# EasyEDA schematic DPSD_NANO_2020-07-29_17-39-39.json
TITLE: Sheet_1; REV: 1.0; Date: 2019-01-28; Sheet: 1/1; Drawn By: ahmetakifkaya11; Company: Your Company
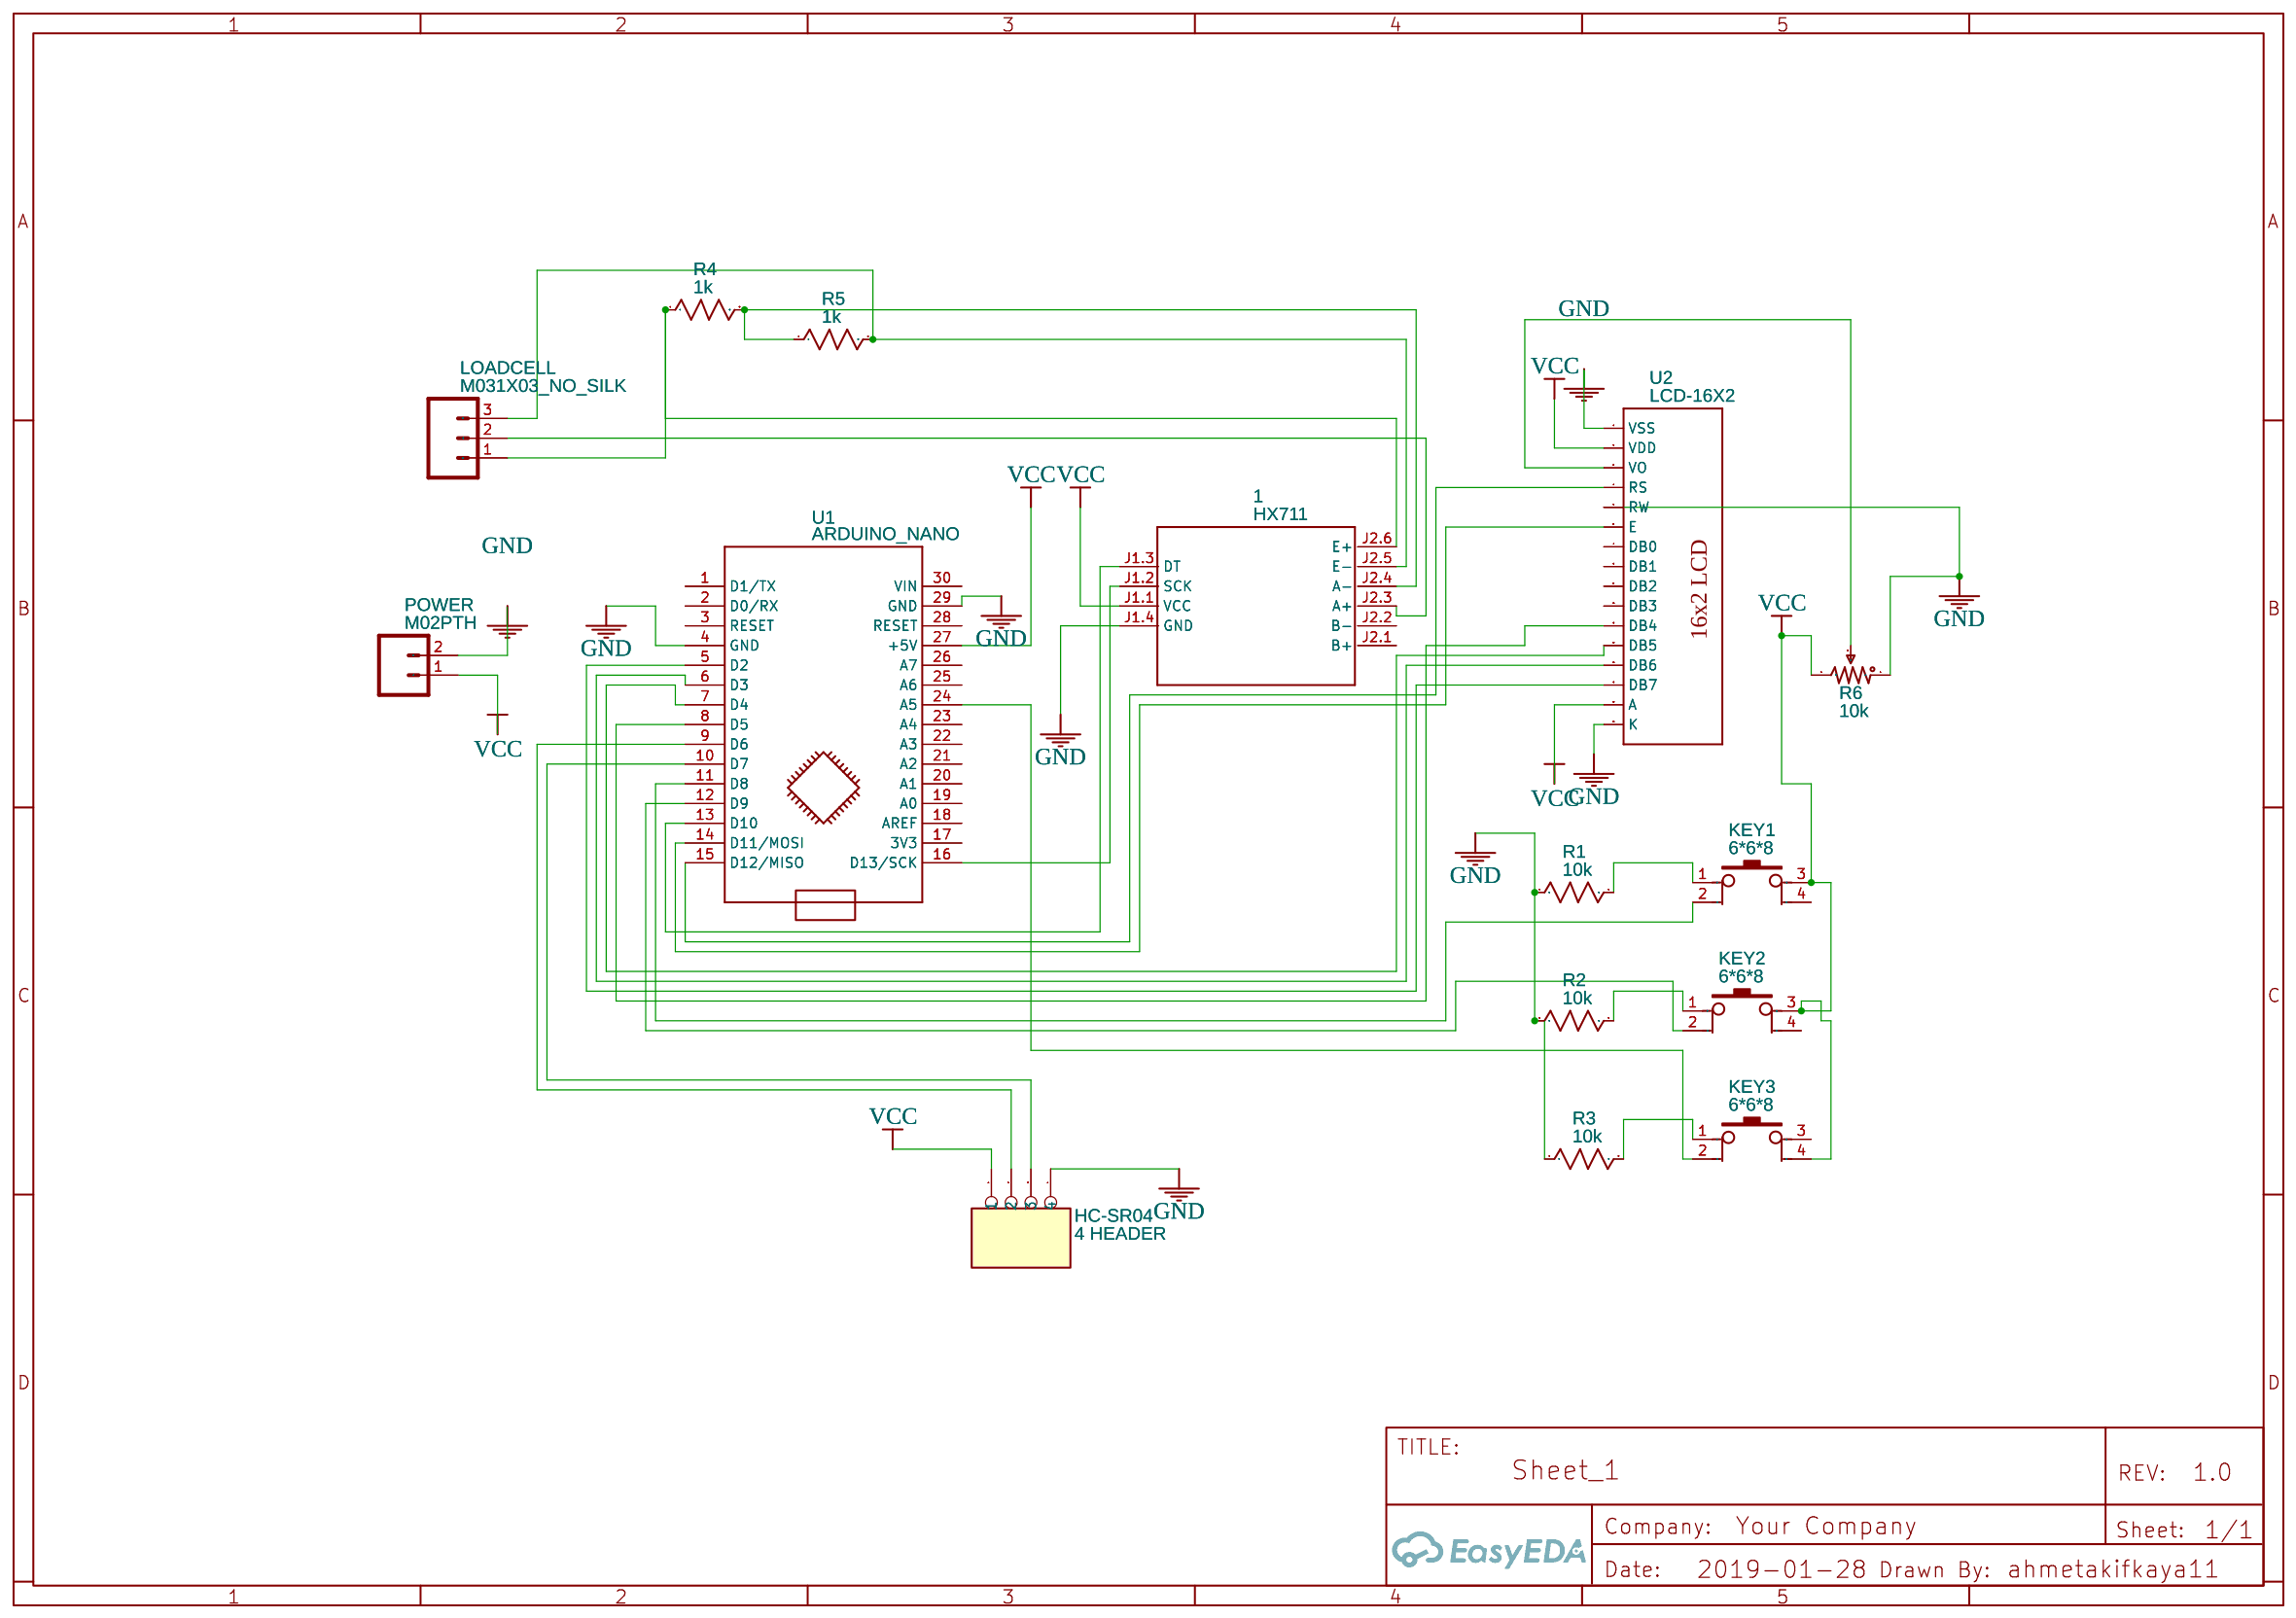
[diagram p0: schematic sheet]

## Parts
1  HX711  [HX711]
HC-SR04  4 HEADER  [HEADER4]
KEY1  6*6*8  [KEY-6.0*6.0-2]
KEY2  6*6*8  [KEY-6.0*6.0-2]
KEY3  6*6*8  [KEY-6.0*6.0-2]
LOADCELL  M031X03_NO_SILK  [1X03_NO_SILK]
POWER  M02PTH  [1X02]
R1  10k  [AXIAL-0.3]
R2  10k  [AXIAL-0.3]
R3  10k  [AXIAL-0.3]
R4  1k  [AXIAL-0.3]
R5  1k  [AXIAL-0.3]
R6  10k  [RES-ADJ_3386P]
U1  ARDUINO_NANO  [ARDUINO_NANO]
U2  LCD-16X2  [LCD-16X2]

## Library data of the parts
1 = -: Contributor: Krzysztof Handzlik; Manufacturer Part: ?
HC-SR04 = -: 4 Pin Header; Manufacturer Part: ?
KEY1-KEY3 = -: Supplier Part: C59982; Supplier: LCSC; Manufacturer: ReliaPro; Manufacturer Part: button6*6*8
LOADCELL = -: Header 3; Manufacturer Part: ?
POWER = -: Header 2; Manufacturer Part: ?
R1-R5 = Res_AXIAL-0.3(1/8W)_US: Manufacturer Part: ?
R6 = 3386P-1-101LF_US: Supplier: LCSC; Manufacturer: Bochen; Manufacturer Part: 3386P-1-101LF; Contributor: EasyEDA; Supplier Part: C125022
U1 = -: sourceId: KGSeAWhDB; Manufacturer Part: ?
U2 = -: Contributor: SparkFun; Manufacturer Part: ?

## Nets
GND: 1.J1.4(GND) HC-SR04.4 POWER.2 R1.1 R2.1 R3.1 R6.1 U1.4(GND) U1.29(GND) U2.1(VSS) U2.5(RW) U2.16(K)
VCC: 1.J1.1(VCC) HC-SR04.1 KEY1.3 KEY2.3 KEY3.4 POWER.1 R6.3 U1.27(+5V) U2.2(VDD) U2.15(A)
Net-(1-J1.2): 1.J1.2(SCK) U1.16(D13/SCK)
Net-(1-J1.3): 1.J1.3(DT) U1.13(D10)
Net-(1-J2.3): 1.J2.3(A+) LOADCELL.2
Net-(1-J2.4): 1.J2.4(A-) R4.2 R5.1
Net-(1-J2.5): 1.J2.5(E-) LOADCELL.3 R5.2
Net-(1-J2.6): 1.J2.6(E+) LOADCELL.1 R4.1
Net-(HC-SR04-2): HC-SR04.2 U1.9(D6)
Net-(HC-SR04-3): HC-SR04.3 U1.10(D7)
Net-(KEY1-1): KEY1.1 R1.2
Net-(KEY1-2): KEY1.2 U1.11(D8)
Net-(KEY2-1): KEY2.1 R2.2
Net-(KEY2-2): KEY2.2 U1.12(D9)
Net-(KEY3-1): KEY3.1 R3.2
Net-(KEY3-2): KEY3.2 U1.24(A5)
Net-(R6-2): R6.2 U2.3(VO)
Net-(U1-5): U1.5(D2) U2.14(DB7)
Net-(U1-6): U1.6(D3) U2.13(DB6)
Net-(U1-7): U1.7(D4) U2.12(DB5)
Net-(U1-8): U1.8(D5) U2.11(DB4)
Net-(U1-14): U1.14(D11/MOSI) U2.6(E)
Net-(U1-15): U1.15(D12/MISO) U2.4(RS)

Not connected (* = marked no-connect by the designer): 1 J2.1(B+) J2.2(B-); KEY1 4; KEY2 4; KEY3 3; U1 1(D1/TX) 2(D0/RX) 3(RESET) 17(3V3) 18(AREF) 19(A0) 20(A1) 21(A2) 22(A3) 23(A4) 25(A6) 26(A7) 28(RESET) 30(VIN); U2 7(DB0) 8(DB1) 9(DB2) 10(DB3)
